# EAGLE design canada150 (EAGLE 7.7.0)
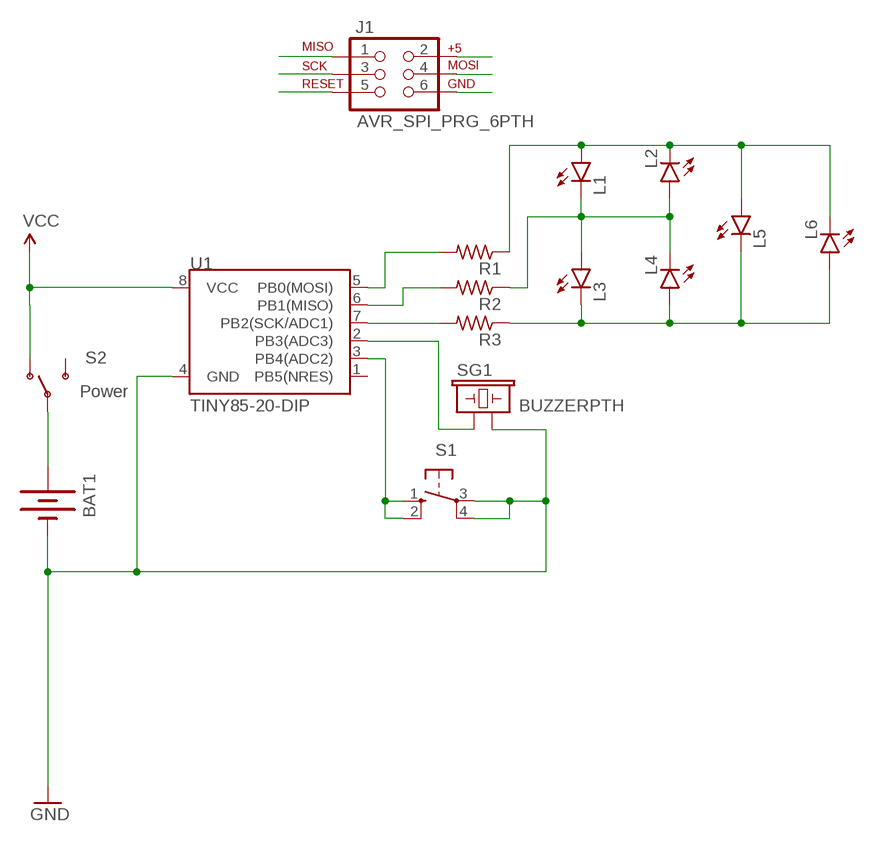
[diagram p0: schematic, sheet 1]

## Parts
BAT1  BATTERY20PTH  [BATTCOM_20MM_PTH]
J1  AVR_SPI_PRG_6PTH  [2X3]
L1  LED5MM  [LED5MM]
L2  LED5MM  [LED5MM]
L3  LED5MM  [LED5MM]
L4  LED5MM  [LED5MM]
L5  LED5MM  [LED5MM]
L6  LED5MM  [LED5MM]
R1  R-US_0204/7  [0204/7]
R2  R-US_0204/7  [0204/7]
R3  R-US_0204/7  [0204/7]
S1  10-XX  [B3F-10XX]
S2  Power  SWITCH-SPDTPTH  [SWITCH-SPDT]
SG1  BUZZERPTH  [BUZZER-12MM]
U1  TINY85-20-DIP  ATTINY45TINY85-20-DIP  [DIP08]

## Nets
GND: BAT1.2(-) J1.6 S1.3(P) S1.4(P1) SG1.- U1.4(GND)
L12: L1.K(C) L2.A L3.A L4.K(C) R2.1
MISO: J1.1 R2.2 U1.6(PB1(MISO))
MOSI: J1.4 R1.2 U1.5(PB0(MOSI))
N$1: BAT1.1(+) S2.2(P)
N$2: L3.K(C) L4.A L5.K(C) L6.A R3.1
N$3: S1.1(S) S1.2(S1) U1.3(PB4(ADC2))
N$4: SG1.+ U1.2(PB3(ADC3))
N$6: L1.A L2.K(C) L5.A L6.K(C) R1.1
RST: J1.5
SCK: J1.3 R3.2 U1.7(PB2(SCK/ADC1))
VCC: J1.2 S2.1(O) U1.8(VCC)
Unconnected: S2.3(S) U1.1(PB5(NRES))

## Library data of the parts
BAT1 = SparkFun-Electromechanical:BATTERY: Battery Holders Various common sizes : AA, AAA, 20mm coin cell and 12mm coin cell. 20MM_4LEGS, BATT-10373
J1 = SparkFun:AVR_SPI_PRG_6: AVR ISP 6 Pin This is the reduced ISP connector for AVR programming. Common on Arduino. This footprint will take up less PCB space and can be used with a 10-pin to 6-pin adapter such as SKU: BOB-08508
L1-L6 = SparkFun-LED:LED: LEDs Standard schematic elements and footprints for 5mm, 3mm, 1206, and 0603 sized LEDs. 5mm - Spark Fun Electronics SKU : COM-00529 (and others)
R1-R3 = rcl:R-US_: RESISTOR, American symbol
S1 = switch-omron:10-XX: OMRON SWITCH; MPN: B3F-1000; OC_FARNELL: 176432; OC_NEWARK: 36M3542
S2 = SparkFun-Electromechanical:SWITCH-SPDT: SPDT Switch Simple slide switch, Spark Fun Electronics SKU : COM-00102 DPDT SMT slide switch, AYZ0202, SWCH-08179
SG1 = SparkFun-Electromechanical:BUZZER: Buzzer 12mm Spark Fun Electronics SKU : Comp-Buzzer
U1 = SparkFun-DigitalIC:ATTINY45: Atmel 8-pin 2/4/8kB flash uC; PROD_ID: IC-09445

## Board
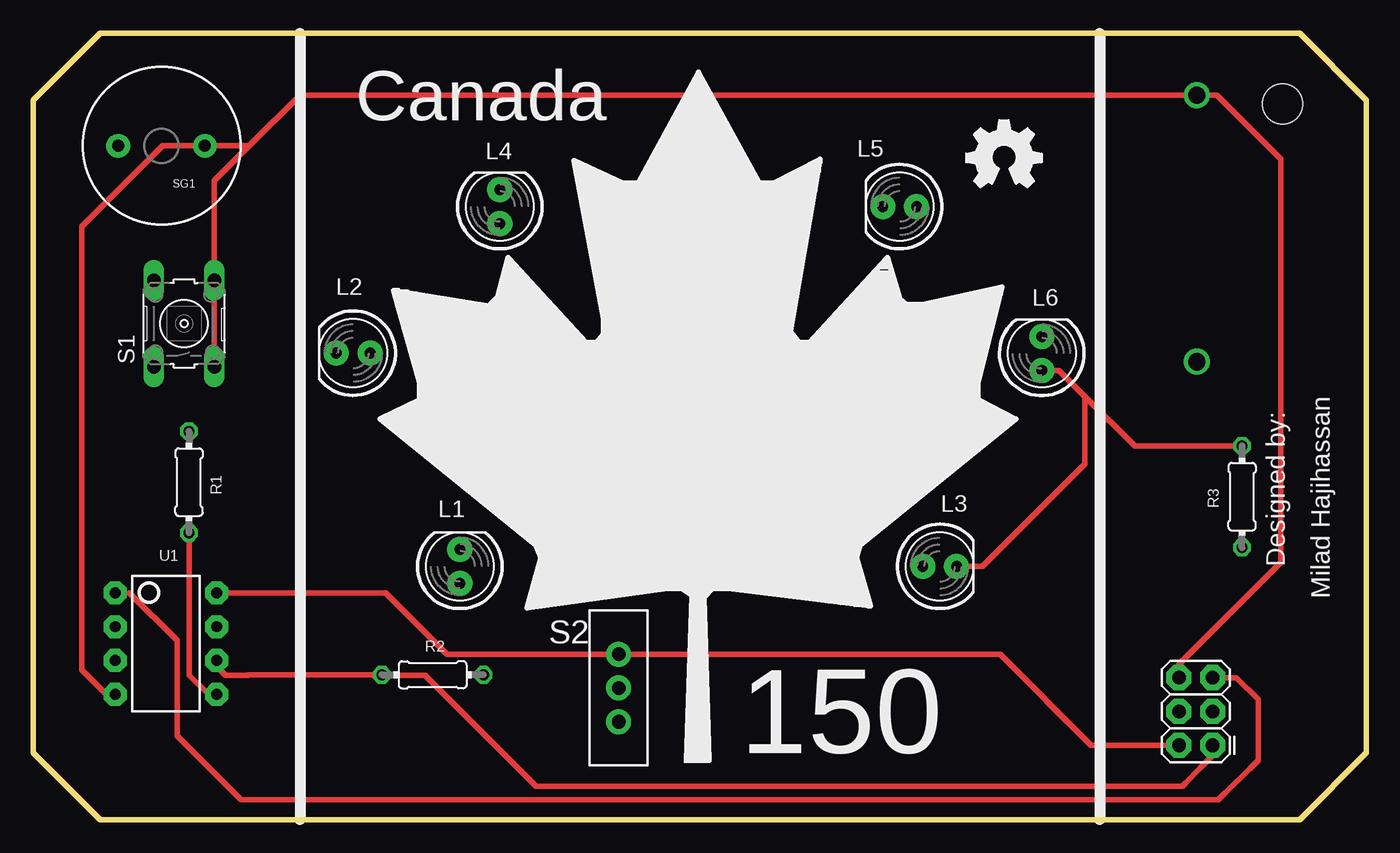
[diagram p1: board, top side]
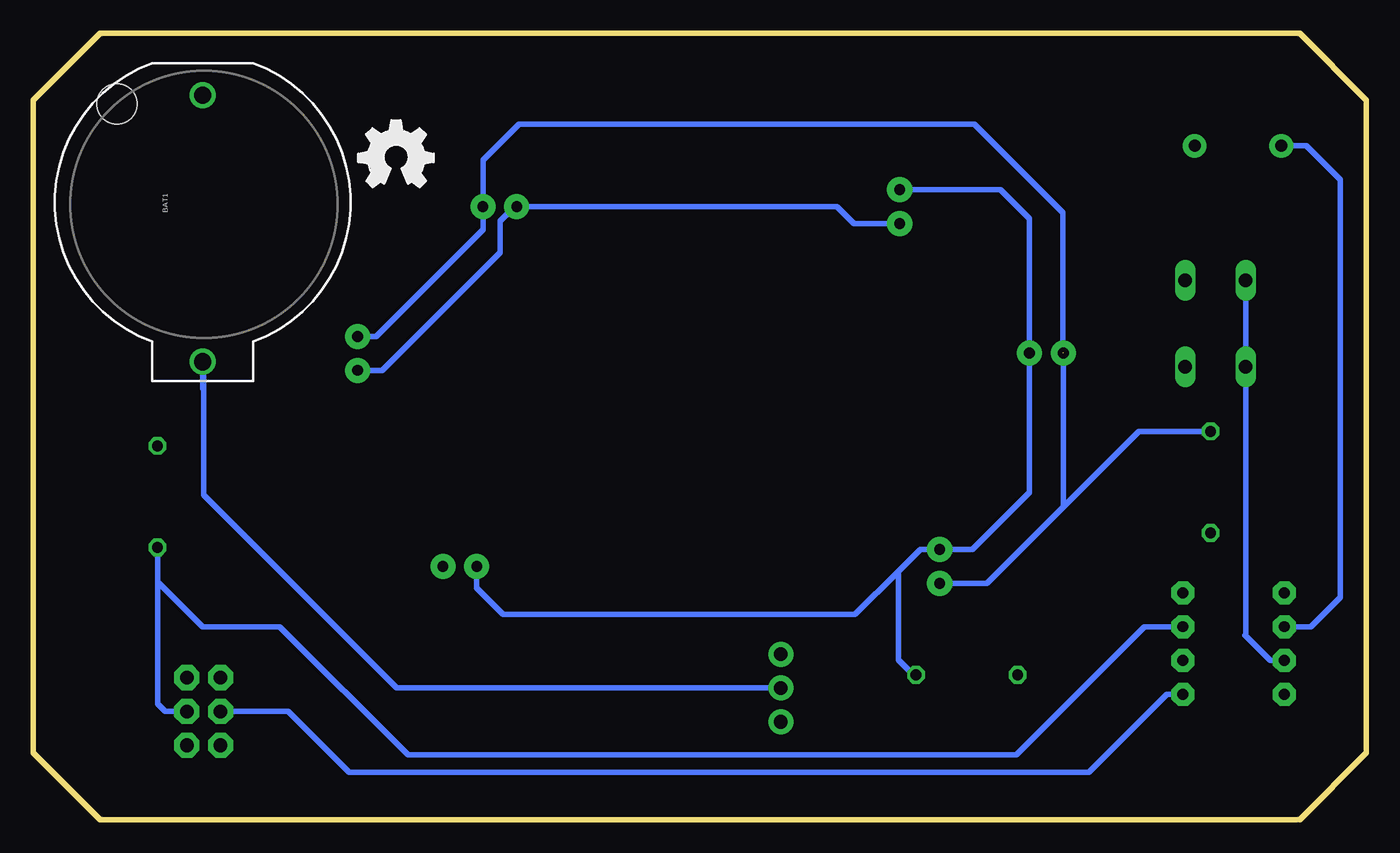
[diagram p2: board, bottom side, seen from below]

Size 100 x 59 mm. Coordinates in mm from the lower left corner, seen from the top.
Outline: 5.21,0 95,0 100,5 100,54 95,59 5,59 0,54 0,5 5,0
Copper layers (1*16): Top 0.035mm / dielectric 1.5mm / Bottom 0.035mm
Design rules "default": minimum track width 6mil, minimum drill 12mil, track to track 6mil, track to pad 6mil, pad to pad 6mil, via to via 6mil, smd to smd 0mil, copper to edge 10mil, drill to drill 10mil, minimum pad ring 10mil, minimum via ring 6mil, stop-mask expansion 2mil, vias tented up to drill 100mil, thermal gap 10mil
Holes 3 mm at 93.72,53.7

### Footprints (pad centres in the part's own frame; a part is rotated, then mirrored left to right if it is on the bottom)
BATTCOM_20MM_PTH = drill 1.3: 1 11.85,0; 2 -8.15,0
2X3 = drill 1.016 pad 1.88 octagon: 1 0,0; 2 0,2.54; 3 2.54,0; 4 2.54,2.54; 5 5.08,0; 6 5.08,2.54
LED5MM = drill 0.813 pad 1.88: A -1.27,0; K 1.27,0
0204/7 = drill 0.813 octagon: 1 -3.81,0; 2 3.81,0
B3F-10XX = drill 1.016 long: 1 -3.251,2.261; 2 3.251,2.261; 3 -3.251,-2.261; 4 3.251,-2.261
SWITCH-SPDT = drill 1.016 pad 1.88: 1 0,2.54; 2 0,0; 3 0,-2.54
BUZZER-12MM = drill 0.9 pad 1.778: + 3.25,0; - -3.25,0
DIP08 = drill 0.813 pad 1.727 octagon: 1 -3.81,-3.81; 2 -1.27,-3.81; 3 1.27,-3.81; 4 3.81,-3.81; 5 3.81,3.81; 6 1.27,3.81; 7 -1.27,3.81; 8 -3.81,3.81

### Placement (x,y rotation side)
BAT1  87.29,46.21 270 bottom
J1  88.49,5.57 90 top
L1  32,19 90 top
L2  24,35 180 top
L3  68,19 0 top
L4  35,46 90 top
L5  65,46 180 top
L6  75.66,34.98 90 top
R1  11.68,25.32 270 top
R2  29.96,10.86 180 top
R3  90.68,24.23 270 top
S1  11.31,37.22 90 top
S2  43.91,9.87 0 top
SG1  9.62,50.56 180 top
U1  9.94,13.2 270 top
U$1  [OSHW_FILLX200_NOTEXT]  69.99,47.42 0 top
U$2  [OSHW_FILLX200_NOTEXT]  75.62,47.42 0 bottom

### Tracks (layer width: path | path; a pad name or v marks a point on that pad's centre or on a via)
GND
  Top 0.406: U1.4 5.47,9.39 3.64,11.22 3.64,44.5 9.7,50.56 SG1.- 16.2,50.56 | J1.6 85.95,11.63 93.6,19.28 93.6,49.57 88.81,54.36 BAT1.2 20,54.36 16.2,50.56 | 16.2,50.56 13.57,47.93 S1.4 S1.3
L12
  Bottom 0.406: R2.1 33.96,10.86 35.1,12 35.1,18.63 | L4.K 27.43,47.27 25.27,45.11 L2.A 25.27,24.56 29.56,20.27 L1.K 33.46,20.27 35.1,18.63 | 35.1,18.63 38.35,15.38 64.74,15.38 66.56,17.2 66.69,17.33 66.73,17.37 L3.A
MISO
  Top 0.406: U1.6 13.75,11.51 14.43,10.83 16.12,10.83 16.15,10.86 R2.2 27.45,10.83 29.38,10.83 37.7,2.51 86.19,2.51 86.45,2.77 87.56,3.88 88.49,4.81 J1.1
MOSI
  Top 0.406: R1.2 11.68,12.02 11.7,12 11.7,10.83 13.14,9.39 U1.5
  Bottom 0.406: U1.5 14.96,9.39 20.8,3.55 76.31,3.55 80.87,8.11 J1.4
N$1
  Bottom 0.406: BAT1.1 87.29,33.32 | 87.29,33.32 87.29,32.34 | S2.2 72.75,9.87 87.23,24.35 87.23,33.26 87.29,33.32
N$2
  Top 0.406: L3.K 71.22,19 78.91,26.69 78.91,31.76 | L6.A 76.96,33.71 78.91,31.76 | 78.91,31.76 82.63,28.04 R3.1
  Bottom 0.406: L4.A 38.45,44.73 39.72,46 L5.K 63.89,46 65,44.89 65,42.55 73.84,33.71 L6.A
N$3
  Bottom 0.406: U1.3 7.21,11.93 9.05,13.77 | 9.05,13.77 9.1,13.82 | S1.1 9.05,35.14 | S1.1 9.05,13.77 | S1.2 S1.1
N$4
  Bottom 0.406: SG1.+ 4.5,50.56 1.95,48.01 1.95,16.68 4.16,14.47 U1.2
N$6  (1 unrouted)
  Bottom 0.406: 22.73,23.46 28.46,17.73 | 28.46,17.73 28.47,17.72 | 22.75,35.02 22.75,45.54 29.38,52.17 63.57,52.17 66.27,49.47 L5.A 66.27,44.27 74.29,36.25 L6.K | L1.A 28.46,17.73 | L2.K 22.73,23.46 | 22.73,23.46 17.06,29.13 R1.1
RST
  Top 0.406: 7.21,17.01 10.79,13.43 10.79,6.28 15.6,1.47 88.92,1.47 89.44,1.99 91.26,3.81 91.91,4.46 91.91,9.01 90.27,10.65 J1.5
SCK
  Bottom 0.406: U1.7 16.64,14.47 26.26,4.85 71.89,4.85 81.51,14.47 87.3,14.47 90.68,17.85 | J1.3 90.1,8.11 90.68,8.69 90.68,17.85 | R3.2 90.68,17.85
VCC
  Top 0.406: 66.43,12.41 S2.1 31.05,12.41 26.45,17.01 U1.8 | 66.43,12.41 68.1,12.41 | J1.2 79.36,5.57 72.54,12.39 66.45,12.39 66.43,12.41

### Text on the board
tPlace: 150
tNames: Canada | Designed by: | Milad Hajihassan